# Altium schematic sheet IN-14 VALVE.SchDoc
size A4; SheetNumber: 5; SheetTotal: 9
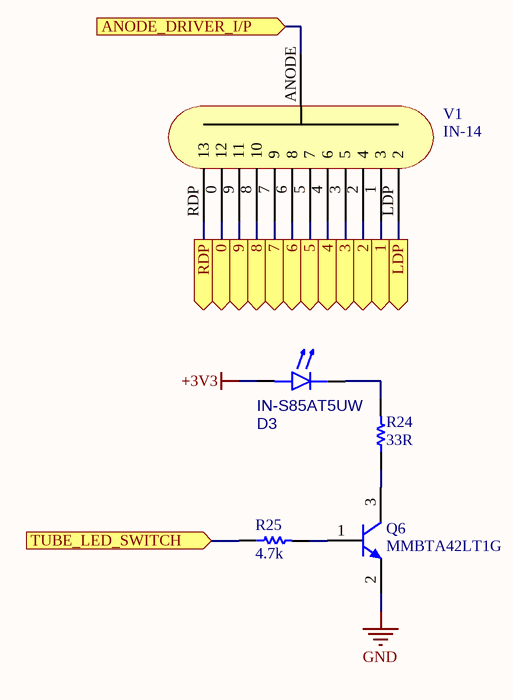
[diagram p0: IN-14 VALVE.SchDoc]

## Parts
?  (no value)
D3  IN-S85AT5UW  [DIOC2012X11N]
Q6  MMBTA42LT1G  [ONSC-SOT-23-3-318-08_V]
R24  value 33R  [RESC1608X55X25NL10T15]  (hidden comment: ERJ-3EKF33R0V)
R25  value 4.7k  [RESC1608X55X25NL10T15]  (hidden comment: Resistor 4k7 +/-1% 0603 100 mW)
V1  IN-14  [Nixie IN-14 Valve]

## Ports
0 (out), 1 (out), 2 (out), 3 (out), 4 (out), 5 (out), 6 (out), 7 (out), 8 (out), 9 (out), ANODE_DRIVER_I/P (in), LDP (out), RDP (out), TUBE_LED_SWITCH (in)

## Nets
+3V3: D3.2(A)
GND: Q6.2(E)
0: V1.0(12) ; port 0
1: V1.1(3) ; port 1
2: V1.2(4) ; port 2
3: V1.3(5) ; port 3
4: V1.4(6) ; port 4
5: V1.5(7) ; port 5
6: V1.6(8) ; port 6
7: V1.7(9) ; port 7
8: V1.8(10) ; port 8
9: V1.9(11) ; port 9
ANODE_DRIVER_I/P: V1.ANODE ; port ANODE_DRIVER_I/P
LDP: V1.LDP(2) ; port LDP
RDP: V1.RDP(13) ; port RDP
TUBE_LED_SWITCH: R25.1 ; port TUBE_LED_SWITCH
NetD3_1: D3.1(K) R24.2
NetQ6_1: Q6.1(B) R25.2
NetQ6_3: Q6.3(C) R24.1

## Notes on the sheet
- Project:
- Designer:
- Sheet
- of
- Filename:

## Library data of the parts
? = CMP-00003-4: The KETS Schematic Sheet Title Block
D3 = CMP-007-00039-1: SMD LED - Mono Color Top View, 805 1.1mm LED PCB Type, White, High Brightness, Clear Lens, Angle 120; Reverse Voltage: 5V; Nominal Vf: 3.4V; Number of Circuits: 1; Luminous Intensity: 285mcd; Forward Voltage: 2.8V; Forward Current: 25mA; Shape: Rectangular; Viewing Angle: 120°; RoHS Compliant: Yes; Height: 1.1mm; Terminal Pitch: 1.6mm; Number of Terminals: 2; Min Operating Temperature: -30°C; Pins: 2; Colour: White; Max Operating Temperature: 85°C; Color: White; Case/Package: 0805; Mounting Technology: Surface Mount; RoHS: Non-Compliant; Lens Style: Clear; Schedule B: 8541402000
Q6 = CMP-013-00062-1: Bipolar (BJT) Single Transistor, General Purpose, NPN, 300 V, 500 mA, 225 mW, SOT-23, Surface Mount; Manufacturer Lifecycle Status: ACTIVE; Frequency: 50MHz; Max Collector Current: 500mA; Collector Emitter Breakdown Voltage: 300V; Emitter Base Voltage (VEBO): 6V; Collector Emitter Saturation Voltage: 500mV; Number of Elements: 1; Max Power Dissipation: 300mW; hFE Min: 40; Clock Frequency: 50MHz; Element Configuration: Single; Packaging: Tape and Reel; Lead Free: Lead Free; RoHS: Compliant; Number of Terminals: 3; Lifecycle Status: Production; Current Rating: 500mA; Polarity: NPN; Width: 1.397mm; Case/Package: SOT-23-3; Max Operating Temperature: 150°C; China RoHS: Compliant; Height: 1.016mm; Weight: 4.535924g; Gain Bandwidth Product: 50MHz; Contact Plating: Tin; Schedule B: 8541210080, 8541210080; Pins: 3; Transition Frequency: 50MHz; Voltage Rating (DC): 300V; REACH SVHC: Yes; Collector Emitter Voltage (VCEO): 300V; Min Operating Temperature: -55°C; Collector Base Voltage (VCBO): 300V; Length: 3.0226mm; Max Breakdown Voltage: 300V; Radiation Hardening: No
R24 = CMP-00050-3: Fixed Resistor, Metal Glaze/thick Film, 0.1W, 33ohm, 75V, 1% +/-Tol, 100ppm/Cel, Surface Mount, 0603; Package Width: 0.8mm; Package Height: 0.45mm; Rated Temperature: 70°C; Power: 100mW; Reference Standard: AEC-Q200; Package Length: 1.6mm; Temperature Coefficient: 100ppm/°C; Max Operating Temperature: 155°C; Working Voltage: 75V; Resistor Type: FIXED RESISTOR; JESD-609 Code: e3; Technology: METAL GLAZE/THICK FILM; Tolerance: 1%; Reach SVHC Compliant: Yes; Packaging: Tape and Reel; Terminal Finish: Nickel; Case/Package: 0603; Package Shape: Rectangular; Mounting Technology: Surface Mount; Min Operating Temperature: -55°C; RoHS Compliant: Yes; Termination: Wraparound; Construction: Rectangular; Pins: 2; Package Style: SMTMeter
R25 = CMP-009-00031-13: Chip Resistor, 4.7 KOhm, +/- 1%, 0.1 W, -55 to 155 degC, 0603 (1608 Metric); Power: 100mW; RoHS Compliant: True; Min Operating Temperature: -55°C; Tolerance: 1%; Mounting Technology: SM; Max Operating Temperature: 155°C; Pins: 2; Case/Package: 0603
V1 = CMP-00026-00006-13: IN-14 Cold Cathode Valve; Mounting Technology: THT; Case/Package: IN-14; Pins: 13